# Altium schematic sheet TURBINE.SchDoc
size A4
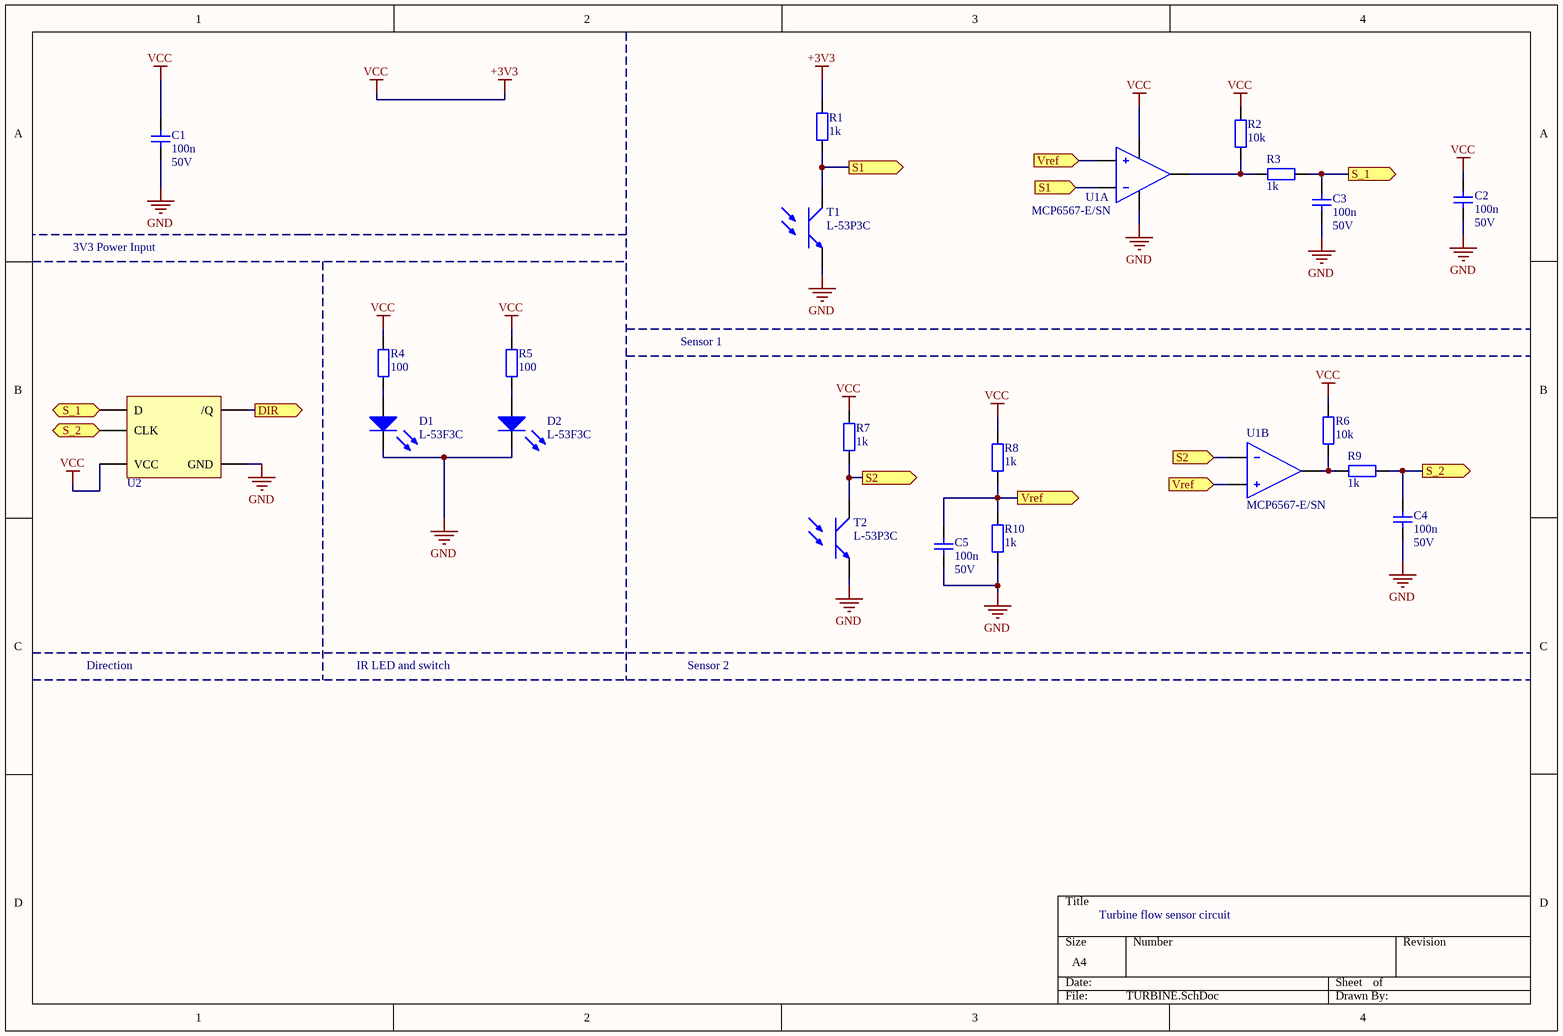
[diagram p0: TURBINE.SchDoc]

## Parts
C1  value 100n  Voltage Rating: 50V  [C1206]  (hidden comment: CAP)
C2  value 100n  Voltage Rating: 50V  [C1206]  (hidden comment: CAP)
C3  value 100n  Voltage Rating: 50V  [C1206]  (hidden comment: CAP)
C4  value 100n  Voltage Rating: 50V  [C1206]  (hidden comment: CAP)
C5  value 100n  Voltage Rating: 50V  [C1206]  (hidden comment: CAP)
D1  L-53F3C  [5mm LED]
D2  L-53F3C  [5mm LED]
R1  value 1k  [R1206]  (hidden comment: 1206)
R2  value 10k  [R1206]  (hidden comment: 1206)
R3  value 1k  [R1206]  (hidden comment: 1206)
R4  value 100  [R1206]  (hidden comment: 1206)
R5  value 100  [R1206]  (hidden comment: 1206)
R6  value 10k  [R1206]  (hidden comment: 1206)
R7  value 1k  [R1206]  (hidden comment: 1206)
R8  value 1k  [R1206]  (hidden comment: 1206)
R9  value 1k  [R1206]  (hidden comment: 1206)
R10  value 1k  [R1206]  (hidden comment: 1206)
T1  L-53P3C  [5mm LED]
T2  L-53P3C  [5mm LED]
U1  MCP6567-E/SN  [SOIC8]  (parts A,B of 2)
U2  SN74AUP1G80DCKR  [SOT23-5]  (value not drawn)

## Ports
DIR (out), S1 (in), S1 (out), S2 (in), S2 (out), S_1 (in), S_1 (out), S_2 (in), S_2 (out), Vref (in), Vref (out)

## Nets
+3V3: C1.1 C2.1 R1.1 R2.1 R4.1 R5.1 R6.1 R7.1 R8.1 U1.8(VCC) U2.5(VCC)  [also labelled VCC]
GND: C1.2 C2.2 C3.2 C4.2 C5.1 D1.1 D2.1 R10.2 T1.2(E) T2.2(E) U1.4(VSS) U2.3(GND)
DIR: U2.4(/Q) ; port DIR
S1: R1.2 T1.1(C) U1.2(INA-) ; port S1
S2: R7.2 T2.1(C) U1.6(INB-) ; port S2
S_1: C3.1 R3.2 U2.1(D) ; port S_1
S_2: C4.1 R9.2 U2.2(CLK) ; port S_2
Vref: C5.2 R8.2 R10.1 U1.3(INA+) U1.5(INB+) ; port Vref
NetD1_2: D1.2 R4.2
NetD2_2: D2.2 R5.2
NetR2_2: R2.2 R3.1 U1.1(VoutA)
NetR6_2: R6.2 R9.1 U1.7(VoutB)

## Notes on the sheet
- 3V3 Power Input
- Sensor 1
- Direction
- IR LED and switch
- Sensor 2
- Turbine flow sensor circuit

## Library data of the parts
C1-C5 = CAP: Capacitor
D1 D2 = L-53F3C: L-53F3C- IR EMITTING DIODE, 940NM, 5MM; Manufacturer: KINGBRIGHT; Forward Current If(AV): 20; Viewing Angle: 20°; Forward Voltage VF Max: 1.6; Diode Case Style: T-1 3/4 (5; SVHC: No SVHC (15-Jun-2015); No. of Pins: 2; Peak Wavelength: 940; Radiant Intensity: 30mW/Sr<!--FANDB--><div class="features-and-benefits-container"><div class="features-and-benefits-description"><span class="features-benefits-value">The L-53F3C is a 5; Supplier 1: Farnell; Manufacturer Part Number: L-53F3C; RoHS: YES; Stock 1: 8681; Pricing 1: 1=42,58, 10=39,924, 50=37,226, 100=34,359, 250=32,378, 500=27,867, 2000=24,452, 5000=22,007 (EUR); Rise Time: -; Fall Time tf: -; Operating Temperature Min: -40; Operating Temperature Max: 85; Packaging: Each; MSL: -; Operating Temperature Range: -40°C to +85; ComponentLink1URL: http://www.farnell.com/datasheets/1683593.pdf; ComponentLink1Description: http://www.farnell.com/datasheets/1683593.pdf; Supplier Part Number 1: 2290441
R1-R10 = RES: 1206 Resistor
T1 T2 = L-53P3C: L-53P3C- PHOTO TRANSISTOR, NPN 5mm; Manufacturer: KINGBRIGHT; Wavelength Typ: 940; Power Consumption: 100; Transistor Case Style: T-1 3/4 (5; No. of Pins: 2; SVHC: No SVHC (15-Jun-2015); Transistor Polarity: NPN<!--FANDB--><div class="features-and-benefits-container"><div class="features-and-benefits-description"><span class="features-benefits-value">The L-53P3C is a 5mm Phototransistor. It is made of NPN silicon. This phototransistor supports 940; Supplier 1: Farnell; Manufacturer Part Number: L-53P3C; RoHS: YES; Stock 1: 8919; Pricing 1: 1=42,58, 10=39,924, 50=37,226, 100=34,359, 250=32,378, 500=27,867, 2000=24,452, 5000=22,007 (EUR); Viewing Angle: -; Packaging: Each; MSL: -; ComponentLink1URL: http://www.farnell.com/datasheets/1683594.pdf; ComponentLink1Description: http://www.farnell.com/datasheets/1683594.pdf; Supplier Part Number 1: 2290444
U1 = MCP6567-E/SN: MICROCHIP - MCP6567-E/SN - IC, COMPARATOR, DUAL, 1.8V, 8SOIC; Comparator Type: High Speed; No. of Comparators: 2; Response Time: 56; Supply Voltage Range: 1.8V to 5.5; Comparator Case Style: SOIC; No. of Pins: 8; IC Output Type: CMOS, MOS, Open Collector, Open Drain, TTL; SVHC: No SVHC (17-Dec-2014); Approval Category: AEC-Q100; Output Compatibility: CMOS; Supply Current: 100; Supplier 1: Farnell; Manufacturer: MICROCHIP; Manufacturer Part Number: MCP6567-E/SN; RoHS: YES; Stock 1: 827; Pricing 1: 1=220,067, 10=215,008, 100=210,792 (EUR); Operating Temperature Min: -40; Operating Temperature Max: 125; Packaging: Each; MSL: MSL 1 - Unlimited; Amplifier Case Style: SOIC; Termination Type: SMD<!--FANDB--><div class="features-and-benefits-container"></div>; ComponentLink1URL: http://www.farnell.com/datasheets/1791050.pdf; ComponentLink1Description: http://www.farnell.com/datasheets/1791050.pdf
U2 = SN74AUP1G80DCKR: TEXAS INSTRUMENTS - SN74AUP1G80DCKR - FLIP FLOP, D-TYPE, 280MHZ, SC-70-5; Supplier 1: Farnell; Manufacturer: TEXAS INSTRUMENTS; Manufacturer Part Number: SN74AUP1G80DCKR; RoHS: YES; Stock 1: 5995; Pricing 1: 3000=77,993, 15000=69,983, 30000=66,61 (EUR); ComponentLink1URL: http://www.farnell.com/datasheets/1888920.pdf; ComponentLink1Description: http://www.farnell.com/datasheets/1888920.pdf; Supplier Part Number 1: 2436894